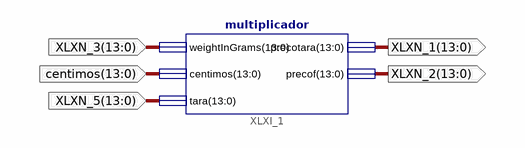
[diagram p0: schematic sheet 1]
// Xilinx ISE schematic TRUES.sch (artix7) as structural Verilog: 1 symbols, 5 ports
module TRUES (
  input  [13:0] XLXN_3,
  input  [13:0] centimos,
  input  [13:0] XLXN_5,
  output [13:0] XLXN_1,
  output [13:0] XLXN_2
);

  multiplicador XLXI_1 (
    .weightInGrams(XLXN_3), .centimos(centimos), .precotara(XLXN_1), .precof(XLXN_2), .tara(XLXN_5));
endmodule
